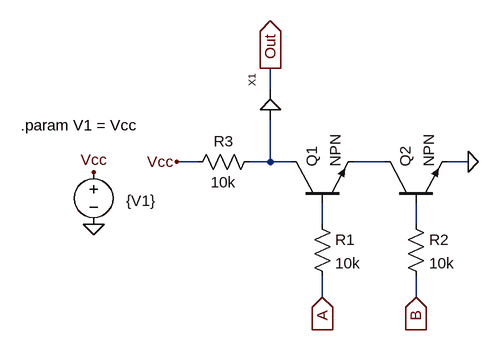
[diagram p0: schematic NAND.asc]
NAND.asc, the LTspice schematic file:
Version 4
SHEET 1 880 680
WIRE 48 -96 48 -128
WIRE -64 16 -96 16
WIRE 48 16 48 -48
WIRE 48 16 16 16
WIRE 80 16 48 16
WIRE 224 16 176 16
WIRE 352 16 320 16
WIRE 128 112 128 80
WIRE 272 112 272 80
WIRE 128 224 128 192
WIRE 272 224 272 192
FLAG 128 224 A
IOPIN 128 224 In
FLAG 272 224 B
IOPIN 272 224 In
FLAG 48 -128 Out
IOPIN 48 -128 Out
FLAG -224 112 0
FLAG -224 32 Vcc
FLAG 352 16 0
FLAG -96 16 Vcc
SYMBOL res 112 96 R0
SYMATTR InstName R1
SYMATTR Value 10k
SYMBOL res 256 96 R0
SYMATTR InstName R2
SYMATTR Value 10k
SYMBOL res 32 0 R90
WINDOW 0 0 56 VBottom 2
WINDOW 3 32 56 VTop 2
SYMATTR InstName R3
SYMATTR Value 10k
SYMBOL npn 80 80 R270
SYMATTR InstName Q1
SYMBOL npn 224 80 R270
SYMATTR InstName Q2
SYMBOL Buffer 48 -48 R270
SYMATTR InstName X1
SYMBOL voltage -224 16 R0
WINDOW 0 24 16 Invisible 2
WINDOW 3 50 60 Left 2
SYMATTR InstName V1
SYMATTR Value {V1}
TEXT -336 -40 Left 2 !.param V1 = Vcc

The netlist it stands for:
* NAND.asc
R1 N003 A 10k
R2 N004 B 10k
R3 N001 Vcc 10k
Q1 N001 N003 N002 0 NPN
Q2 N002 N004 0 0 NPN
XX1 N001 Out Buffer Vcc = 5V  ; pins In Out
V1 Vcc 0 {V1}
.model NPN NPN
.model PNP PNP
.lib standard.bjt
.param V1 = Vcc
.backanno
.end